# EAGLE design Atari 2006 Dumper (EAGLE 9.1.3)
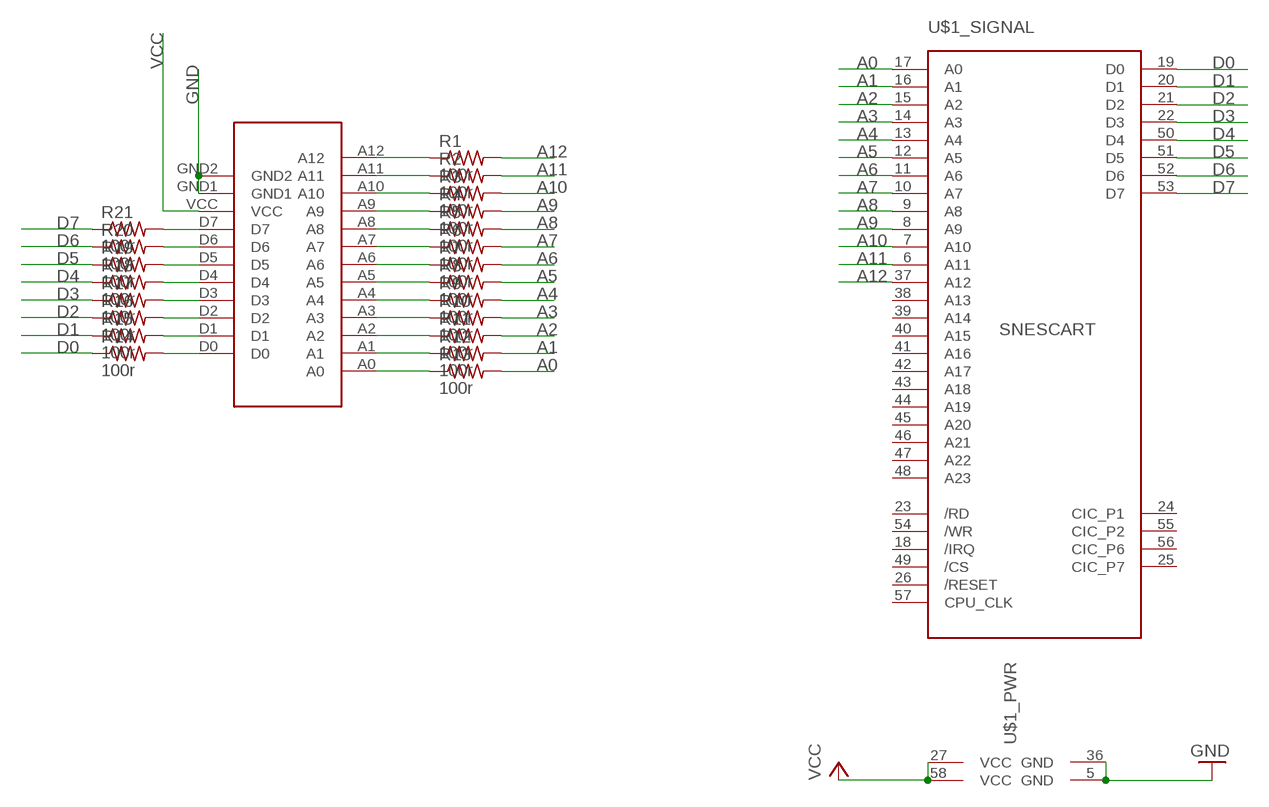
[diagram p0: schematic, sheet 1]

## Parts
R1  100r  R-US_R0603  [R0603]
R2  100r  R-US_R0603  [R0603]
R3  100r  R-US_R0603  [R0603]
R4  100r  R-US_R0603  [R0603]
R5  100r  R-US_R0603  [R0603]
R6  100r  R-US_R0603  [R0603]
R7  100r  R-US_R0603  [R0603]
R8  100r  R-US_R0603  [R0603]
R9  100r  R-US_R0603  [R0603]
R10  100r  R-US_R0603  [R0603]
R11  100r  R-US_R0603  [R0603]
R12  100r  R-US_R0603  [R0603]
R13  100r  R-US_R0603  [R0603]
R14  100r  R-US_R0603  [R0603]
R15  100r  R-US_R0603  [R0603]
R16  100r  R-US_R0603  [R0603]
R17  100r  R-US_R0603  [R0603]
R18  100r  R-US_R0603  [R0603]
R19  100r  R-US_R0603  [R0603]
R20  100r  R-US_R0603  [R0603]
R21  100r  R-US_R0603  [R0603]
U$1  SNESCART  [SNESCART]
U$2  2600CARTBIGGERPADS  [2600EDGE-BIGGER]

## Nets
A0: R13.2 U$1.17(_SIGNAL:A0)
A1: R12.2 U$1.16(_SIGNAL:A1)
A2: R11.2 U$1.15(_SIGNAL:A2)
A3: R10.2 U$1.14(_SIGNAL:A3)
A4: R9.2 U$1.13(_SIGNAL:A4)
A5: R8.2 U$1.12(_SIGNAL:A5)
A6: R7.2 U$1.11(_SIGNAL:A6)
A7: R6.2 U$1.10(_SIGNAL:A7)
A8: R5.2 U$1.9(_SIGNAL:A8)
A9: R4.2 U$1.8(_SIGNAL:A9)
A10: R3.2 U$1.7(_SIGNAL:A10)
A11: R2.2 U$1.6(_SIGNAL:A11)
A12: R1.2 U$1.37(_SIGNAL:A12)
D0: R14.1 U$1.19(_SIGNAL:D0)
D1: R15.1 U$1.20(_SIGNAL:D1)
D2: R16.1 U$1.21(_SIGNAL:D2)
D3: R17.1 U$1.22(_SIGNAL:D3)
D4: R18.1 U$1.50(_SIGNAL:D4)
D5: R19.1 U$1.51(_SIGNAL:D5)
D6: R20.1 U$1.52(_SIGNAL:D6)
D7: R21.1 U$1.53(_SIGNAL:D7)
GND: U$1.5(_PWR:GND) U$1.36(_PWR:GND) U$2.GND1 U$2.GND2
N$1: R1.1 U$2.A12
N$2: R14.2 U$2.D0
N$3: R13.1 U$2.A0
N$4: R15.2 U$2.D1
N$5: R16.2 U$2.D2
N$6: R4.1 U$2.A9
N$7: R3.1 U$2.A10
N$8: R2.1 U$2.A11
N$9: R5.1 U$2.A8
N$10: R6.1 U$2.A7
N$11: R7.1 U$2.A6
N$12: R8.1 U$2.A5
N$13: R9.1 U$2.A4
N$14: R10.1 U$2.A3
N$15: R11.1 U$2.A2
N$16: R12.1 U$2.A1
N$17: R17.2 U$2.D3
N$18: R18.2 U$2.D4
N$19: R19.2 U$2.D5
N$20: R20.2 U$2.D6
N$21: R21.2 U$2.D7
VCC: U$1.27(_PWR:VCC) U$1.58(_PWR:VCC) U$2.VCC
Unconnected: U$1.18(_SIGNAL:/IRQ) U$1.23(_SIGNAL:/RD) U$1.24(_SIGNAL:CIC_P1) U$1.25(_SIGNAL:CIC_P7) U$1.26(_SIGNAL:/RESET) U$1.38(_SIGNAL:A13) U$1.39(_SIGNAL:A14) U$1.40(_SIGNAL:A15) U$1.41(_SIGNAL:A16) U$1.42(_SIGNAL:A17) U$1.43(_SIGNAL:A18) U$1.44(_SIGNAL:A19) U$1.45(_SIGNAL:A20) U$1.46(_SIGNAL:A21) U$1.47(_SIGNAL:A22) U$1.48(_SIGNAL:A23) U$1.49(_SIGNAL:/CS) U$1.54(_SIGNAL:/WR) U$1.55(_SIGNAL:CIC_P2) U$1.56(_SIGNAL:CIC_P6) U$1.57(_SIGNAL:CPU_CLK)

## Library data of the parts
R1-R21 = resistor:R-US_: RESISTOR, American symbol
U$1 = TRP_Custom:SNESCART
U$2 = TRP_Custom:2600CART

## Board
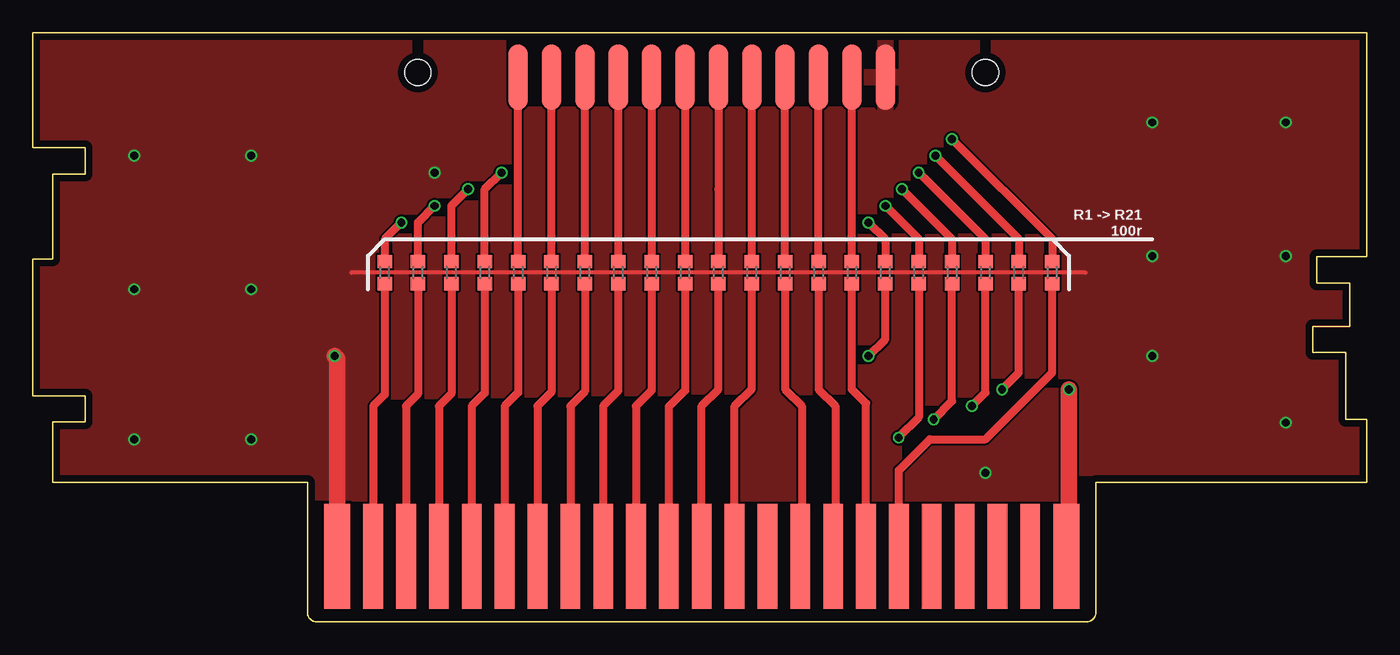
[diagram p1: board, top side]
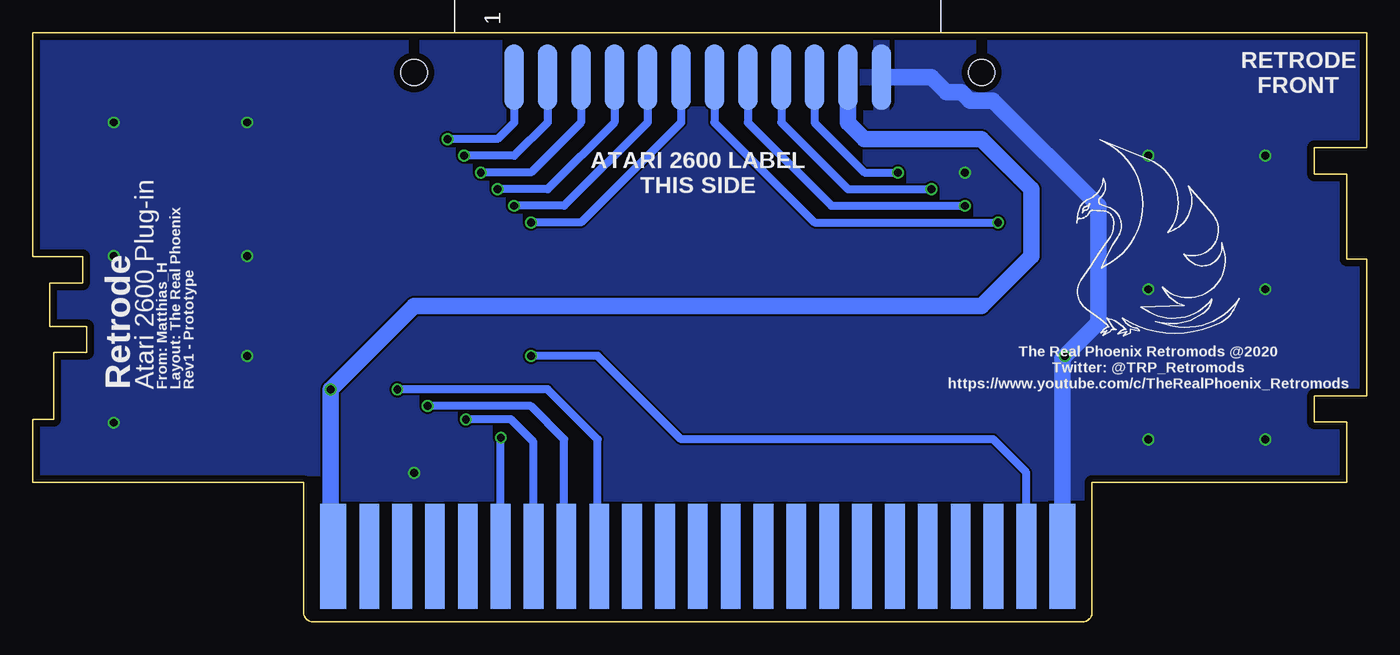
[diagram p2: board, bottom side, seen from below]

Size 101.5 x 44.84 mm. Coordinates in mm from the lower left corner, seen from the top.
Copper layers (1*16): Top 0.035mm / dielectric 1.6mm / Bottom 0.035mm
Design rules "Elecrow_2-layer_PCB_eagle_rule *": minimum track width 6mil, minimum drill 12mil, track to track 6mil, track to pad 6mil, pad to pad 6mil, via to via 8mil, smd to smd 0mil, copper to edge 20mil, drill to drill 10mil, minimum pad ring 6mil, minimum via ring 6mil, stop-mask expansion 0mil, vias tented up to drill 100mil, thermal gap 10mil
Holes 2 mm at 29.31,41.83 72.49,41.83

### Footprints (pad centres in the part's own frame; a part is rotated, then mirrored left to right if it is on the bottom)
R0603 = smd 1 x 1.1: 1 -0.85,0; 2 0.85,0
SNESCART = smd 2 x 8: 5 -27.75,0; 27 27.75,0 | smd 1.5 x 8: 6 -25,0; 7 -22.5,0; 8 -20,0; 9 -17.5,0; 10 -15,0; 11 -12.5,0; 12 -10,0; 13 -7.5,0; 14 -5,0; 15 -2.5,0; 16 0,0; 17 2.5,0; 18 5,0; 19 7.5,0; 20 10,0; 21 12.5,0; 22 15,0; 23 17.5,0; 24 20,0; 25 22.5,0; 26 25,0 | smd 2 x 8 bottom: 36 -27.75,0; 58 27.75,0 | smd 1.5 x 8 bottom: 37 -25,0; 38 -22.5,0; 39 -20,0; 40 -17.5,0; 41 -15,0; 42 -12.5,0; 43 -10,0; 44 -7.5,0; 45 -5,0; 46 -2.5,0; 47 0,0; 48 2.5,0; 49 5,0; 50 7.5,0; 51 10,0; 52 12.5,0; 53 15,0; 54 17.5,0; 55 20,0; 56 22.5,0; 57 25,0
2600EDGE-BIGGER = smd 5 x 1.5 bottom: A0 1.905,-3.81; A1 1.905,-1.27; A2 1.905,1.27; A3 1.905,3.81; A4 1.905,6.35; A5 1.905,8.89; A6 1.905,11.43; A7 1.905,13.97; D0 1.905,-6.35; D1 1.905,-8.89; D2 1.905,-11.43; GND2 1.905,-13.97 | smd 5 x 1.5: A8 1.905,8.89; A9 1.905,6.35; A10 1.905,3.81; A11 1.905,1.27; A12 1.905,-1.27; D3 1.905,-13.97; D4 1.905,-11.43; D5 1.905,-8.89; D6 1.905,-6.35; D7 1.905,-3.81; GND1 1.905,13.97; VCC 1.905,11.43

### Placement (x,y rotation side)
R1  64.87,26.59 270 top
R2  26.77,26.59 270 top
R3  29.31,26.59 270 top
R4  31.85,26.59 270 top
R5  34.39,26.59 270 top
R6  36.93,26.59 270 top
R7  39.47,26.59 270 top
R8  42.01,26.59 270 top
R9  44.55,26.59 270 top
R10  47.09,26.59 270 top
R11  49.63,26.59 270 top
R12  52.17,26.59 270 top
R13  54.71,26.59 270 top
R14  57.25,26.59 90 top
R15  59.79,26.59 90 top
R16  62.33,26.59 90 top
R17  77.57,26.59 90 top
R18  75.03,26.59 90 top
R19  72.49,26.59 90 top
R20  69.95,26.59 90 top
R21  67.41,26.59 90 top
U$1  50.9,5 0 top
U$2  50.9,43.35 270 bottom
U$3  [LOGO]  25.5,20.24 0 bottom

### Tracks (layer width: path | path; a pad name or v marks a point on that pad's centre or on a via)
A0
  Top 0.61: U$1.17 53.4,16.43 54.71,17.74 R13.2
A1
  Top 0.61: R12.2 52.17,17.7 50.9,16.43 U$1.16
A2
  Top 0.61: U$1.15 48.4,16.38 49.63,17.61 R11.2
A3
  Top 0.61: R10.2 47.09,17.62 45.9,16.43 U$1.14
A4
  Top 0.61: R9.2 44.55,17.58 43.4,16.43 U$1.13
A5
  Top 0.61: R8.2 42.01,17.54 40.9,16.43 U$1.12
A6
  Top 0.61: U$1.11 38.4,16.43 39.47,17.5 R7.2
A7
  Top 0.61: U$1.10 35.9,16.43 36.93,17.46 R6.2
A8
  Top 0.61: R5.2 34.39,17.42 33.4,16.43 U$1.9
A9
  Top 0.61: R4.2 31.85,17.38 30.9,16.43 U$1.8
A10
  Top 0.61: R3.2 29.31,17.34 28.4,16.43 U$1.7
A11
  Top 0.61: R2.2 26.77,17.3 25.9,16.43 U$1.6
A12  (via drill 0.6)
  Top 0.61: v63.6,20.24 64.87,21.51 R1.2
  Bottom 0.61: U$1.37 25.9,11.37 28.42,13.89 52.17,13.89 58.52,20.24 v63.6,20.24
D0
  Top 0.61: R14.1 57.25,17.7 58.52,16.43 58.52,5.12 U$1.19
D1
  Top 0.61: R15.1 59.79,17.7 61.06,16.43 61.06,5.16 U$1.20
D2
  Top 0.61: R16.1 62.33,17.7 63.4,16.63 U$1.21
D3
  Top 0.61: U$1.22 65.9,11.53 68.26,13.89 72.49,13.89 77.57,18.97 R17.1
D4  (via drill 0.6)
  Top 0.61: v73.76,17.7 75.03,18.97 R18.1
  Bottom 0.61: U$1.50 58.52,5.12 58.52,13.89 62.33,17.7 v73.76,17.7
D5  (via drill 0.6)
  Top 0.61: v71.47,16.43 72.49,17.45 R19.1
  Bottom 0.61: U$1.51 61.06,5.16 61.06,13.89 63.6,16.43 v71.47,16.43
D6  (via drill 0.6)
  Top 0.61: v68.55,15.41 69.95,16.81 R20.1
  Bottom 0.61: U$1.52 63.4,13.69 65.12,15.41 v68.55,15.41
D7  (via drill 0.6)
  Top 0.61: v65.89,14.02 65.89,14.06 67.41,15.58 R21.1
  Bottom 0.61: U$1.53 65.9,14 v65.89,14.02
GND  (via drill 0.6)
  Top 0.305: 80.11,26.59 24.23,26.59
  Top 1.27: U$1.5 23.15,20.05 v22.96,20.24
  Bottom 1.27: U$1.5 23.15,20.05 v22.96,20.24 20.42,22.78 20.42,26.59 20.42,31.67 28.44,39.69 30.2,39.69 30.83,40.32 31.99,40.32 33.12,41.45 U$2.GND1
  other vias: 7.72,35.48 7.72,25.32 7.72,13.89 95.35,38.02 95.35,27.86 95.35,15.16 85.19,20.24 85.19,27.86 85.19,38.02 16.61,35.48 16.61,25.32 16.61,13.89 30.58,34.21 72.49,11.35
  pour Bottom: 20.17,17.19 26.14,17.19 26.14,12.24 20.17,12.24 20.17,17.06
  pour Bottom: 84.43,17.45 84.43,11.6 90.27,11.6 90.27,17.57 84.56,17.57
  pour Top: -1.17,46.91 104.24,46.91 104.24,6.27 -1.17,6.27
  pour Bottom: -1.17,46.91 104.24,46.91 104.24,6.27 -1.17,6.27
N$1  (via drill 0.6)
  Top 0.61: v63.6,30.4 64.87,29.13 R1.1
  Bottom 0.61: U$2.A12 52.17,38.02 59.79,30.4 v63.6,30.4
N$2
  Top 0.61: R14.2 U$2.D0
N$3
  Top 0.61: R13.1 54.71,36.75 U$2.A0
N$4
  Top 0.61: R15.2 U$2.D1
N$5
  Top 0.61: R16.2 U$2.D2
N$6  (via drill 0.6)
  Top 0.61: R4.1 31.85,31.67 v33.12,32.94
  Bottom 0.61: U$2.A9 44.55,38.02 39.47,32.94 v33.12,32.94
N$7  (via drill 0.6)
  Top 0.61: R3.1 29.31,30.4 v30.58,31.67
  Bottom 0.61: U$2.A10 47.09,38.02 40.74,31.67 v30.58,31.67
N$8  (via drill 0.6)
  Top 0.61: v28.04,30.4 26.77,29.13 R2.1
  Bottom 0.61: U$2.A11 49.63,38.02 42.01,30.4 v28.04,30.4
N$9  (via drill 0.6)
  Top 0.61: R5.1 34.39,32.94 v35.66,34.21
  Bottom 0.61: U$2.A8 42.01,38.02 38.2,34.21 v35.66,34.21
N$10
  Top 0.61: R6.1 U$2.A7
N$11
  Top 0.61: R7.1 U$2.A6
N$12
  Top 0.61: R8.1 U$2.A5
N$13
  Top 0.61: R9.1 44.55,34.21 U$2.A4
N$14
  Top 0.61: U$2.A3 47.09,36.75 R10.1
N$15
  Top 0.61: U$2.A2 49.63,32.94 R11.1
N$16
  Top 0.61: U$2.A1 52.17,32.94 R12.1
N$17  (via drill 0.6)
  Top 0.61: v69.95,36.75 77.57,29.13 R17.2
  Bottom 0.61: U$2.D3 64.87,38.02 66.14,36.75 v69.95,36.75
N$18  (via drill 0.6)
  Top 0.61: v68.68,35.48 75.03,29.13 R18.2
  Bottom 0.61: v68.68,35.48 64.87,35.48 62.33,38.02 U$2.D4
N$19  (via drill 0.6)
  Top 0.61: v67.41,34.21 72.49,29.13 R19.2
  Bottom 0.61: U$2.D5 59.79,38.02 63.6,34.21 v67.41,34.21
N$20  (via drill 0.6)
  Top 0.61: v66.14,32.94 69.95,29.13 R20.2
  Bottom 0.61: U$2.D6 57.25,38.02 62.33,32.94 v66.14,32.94
N$21  (via drill 0.6)
  Top 0.61: v64.87,31.67 67.41,29.13 R21.2
  Bottom 0.61: U$2.D7 54.71,38.02 61.06,31.67 v64.87,31.67
VCC  (via drill 0.6)
  Top 1.27: U$1.58 78.84,5.19 v78.84,17.7
  Bottom 1.27: U$2.VCC 39.47,38.02 38.2,36.75 29.31,36.75 25.5,32.94 25.5,27.86 29.31,24.05 72.49,24.05 v78.84,17.7 78.84,5.19 U$1.58

### Text on the board
tNames: R1 -> R21 / 100r
bNames: RETRODE / FRONT | ATARI 2600 LABEL / THIS SIDE | The Real Phoenix Retromods @2020 / Twitter: @TRP_Retromods / https://www.youtube.com/c/TheRealPhoenix_Retromods | Rev1 - Prototype | Layout: The Real Phoenix | From: Matthias_H | Atari 2600 Plug-in | Retrode